# EAGLE design DIYBadgeKit-v10 (EAGLE 6.3)
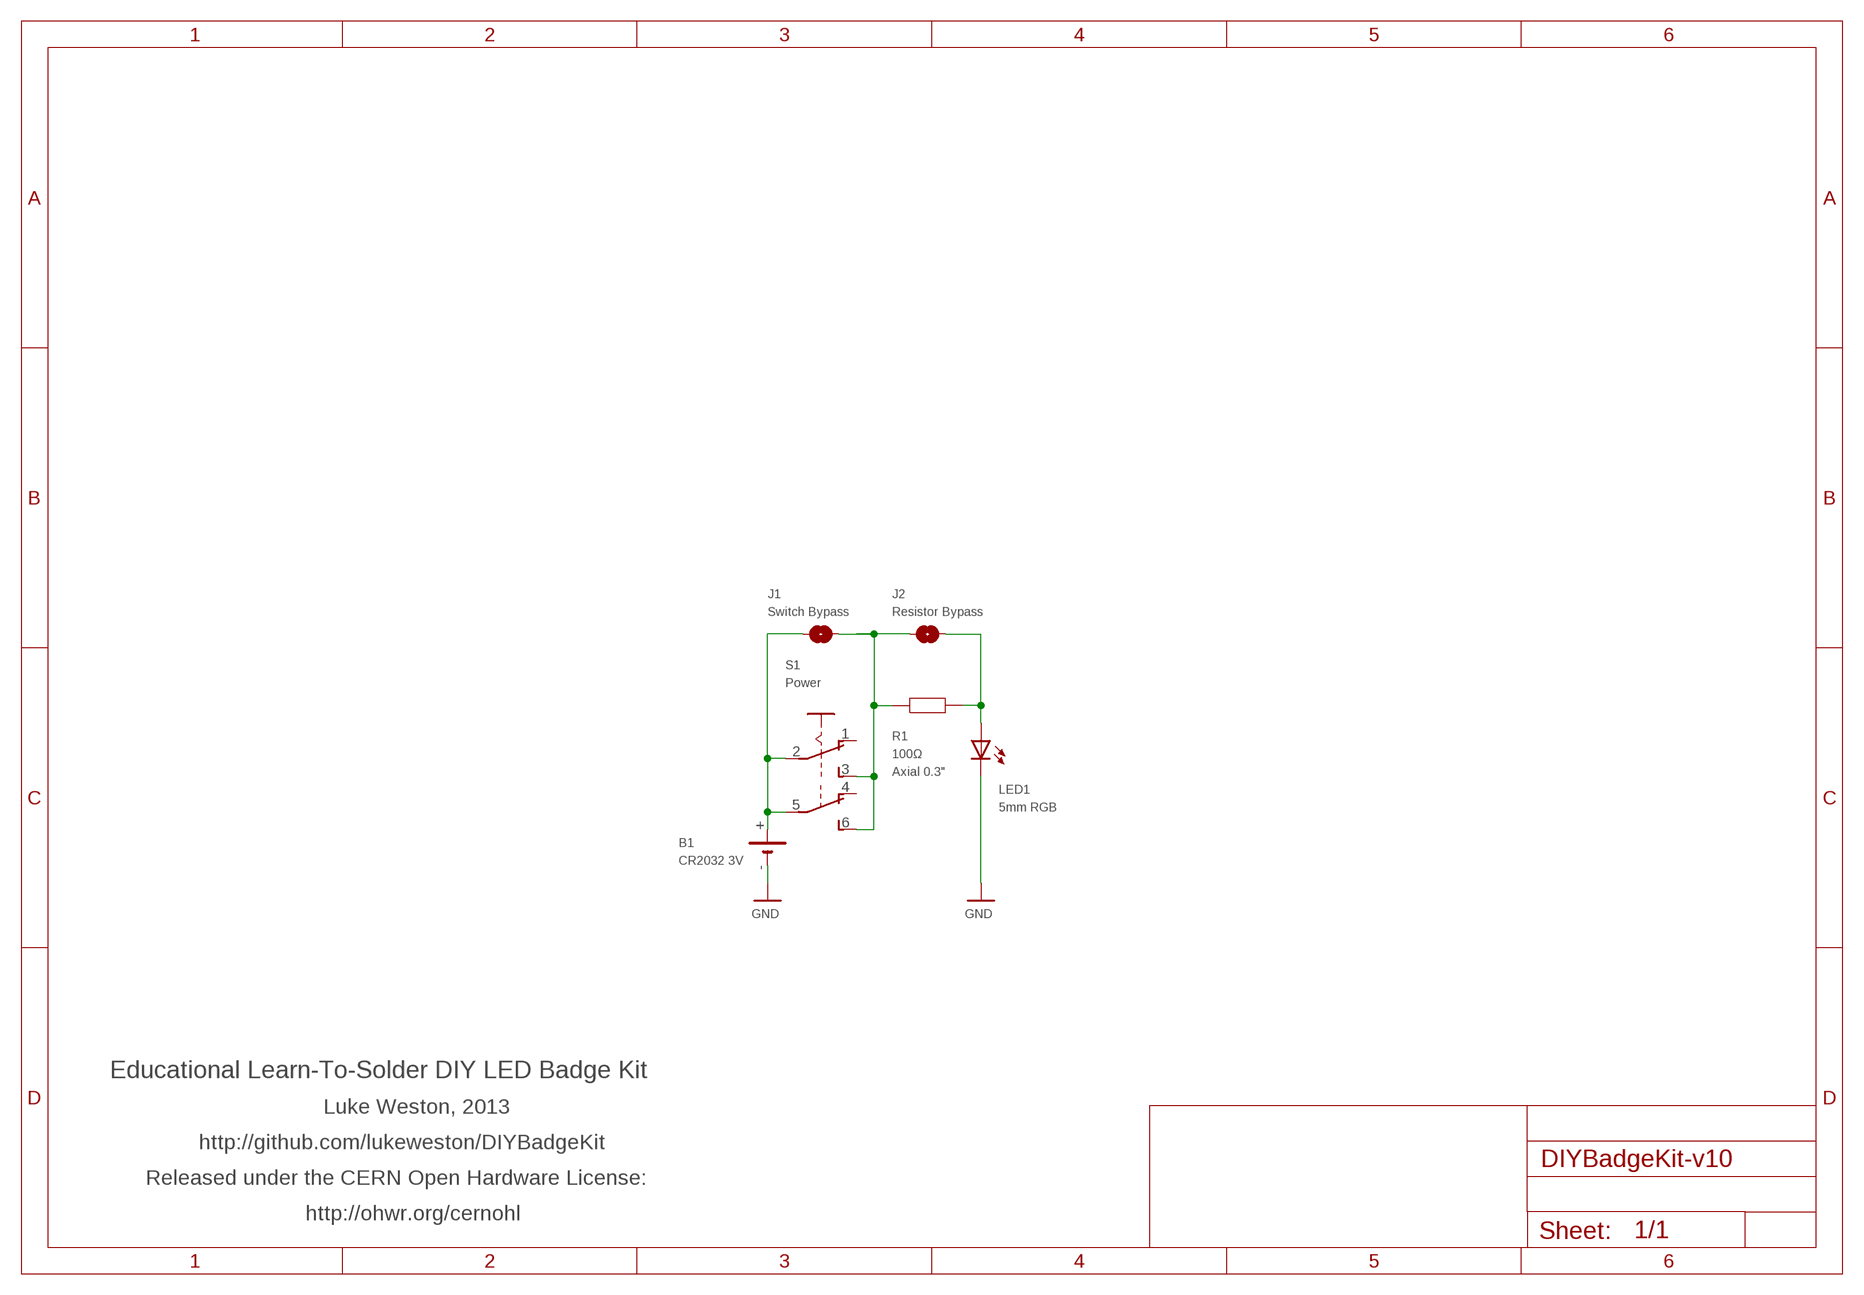
[diagram p0: schematic, sheet 1]

## Parts
B1  CR2032 3V  B2430UNI  [B2430UNI]
J1  Switch Bypass  SJ  [SJ]
J2  Resistor Bypass  SJ  [SJ]
LED1  5mm RGB  LED5MM  [LED5MM]
R1  100Ω  RESISTORPTH1  [AXIAL-0.3]
S1  Power  A68-A31  [A68-A31]

## Nets
GND: B1.- B1.-@1(-) LED1.K(C)
J2: J2.2 LED1.A R1.P$2
N$2: J1.2 J2.1 R1.P$1 S1.3(A:S) S1.6(B:S)
N$3: B1.+ B1.+@1(+) B1.+@2(+) B1.+@3(+) B1.+@4(+) J1.1 S1.2(A:P) S1.5(B:P)
Unconnected: S1.1(A:O) S1.4(B:O)

## Notes on the sheet
- Educational Learn-To-Solder DIY LED Badge Kit
- Luke Weston, 2013
- http://github.com/lukeweston/DIYBadgeKit
- Released under the CERN Open Hardware License:
- http://ohwr.org/cernohl

## Library data of the parts
B1 = battery:B2430UNI: LI BATTERY
J1 J2 = freetronics-luke:SJ: PCB "solder jumper". Note that there should nothing on the BOM corresponding to this "component".
LED1 = freetronics-master-v1:LED: LEDs Standard schematic elements and footprints for 5mm, 3mm, 1206, and 0603 sized LEDs. 5mm - Spark Fun Electronics SKU : COM-00529 (and others)
R1 = freetronics-master-v1:RESISTOR: Resistor Basic schematic elements and footprints for 0603, 1206, and PTH 1/10th watt (small) resistors.; PACKAGE: Axial 0.3"
S1 = switch:A68-A31: SLIDING SWITCH Siemens, distributor Buerklin, 11G766

## Board
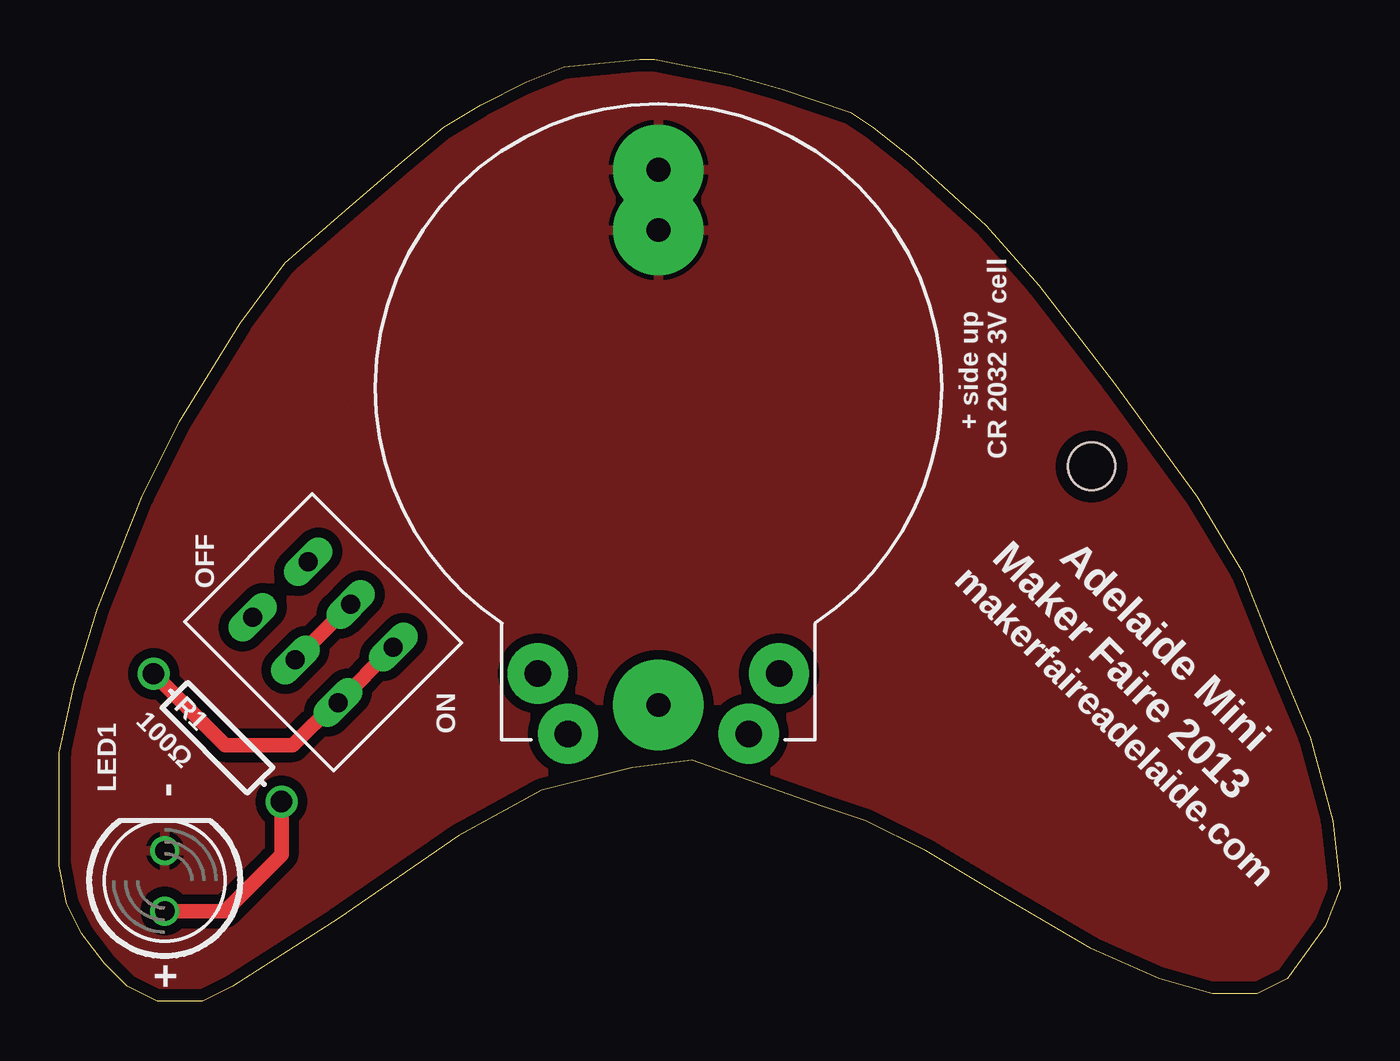
[diagram p1: board, top side]
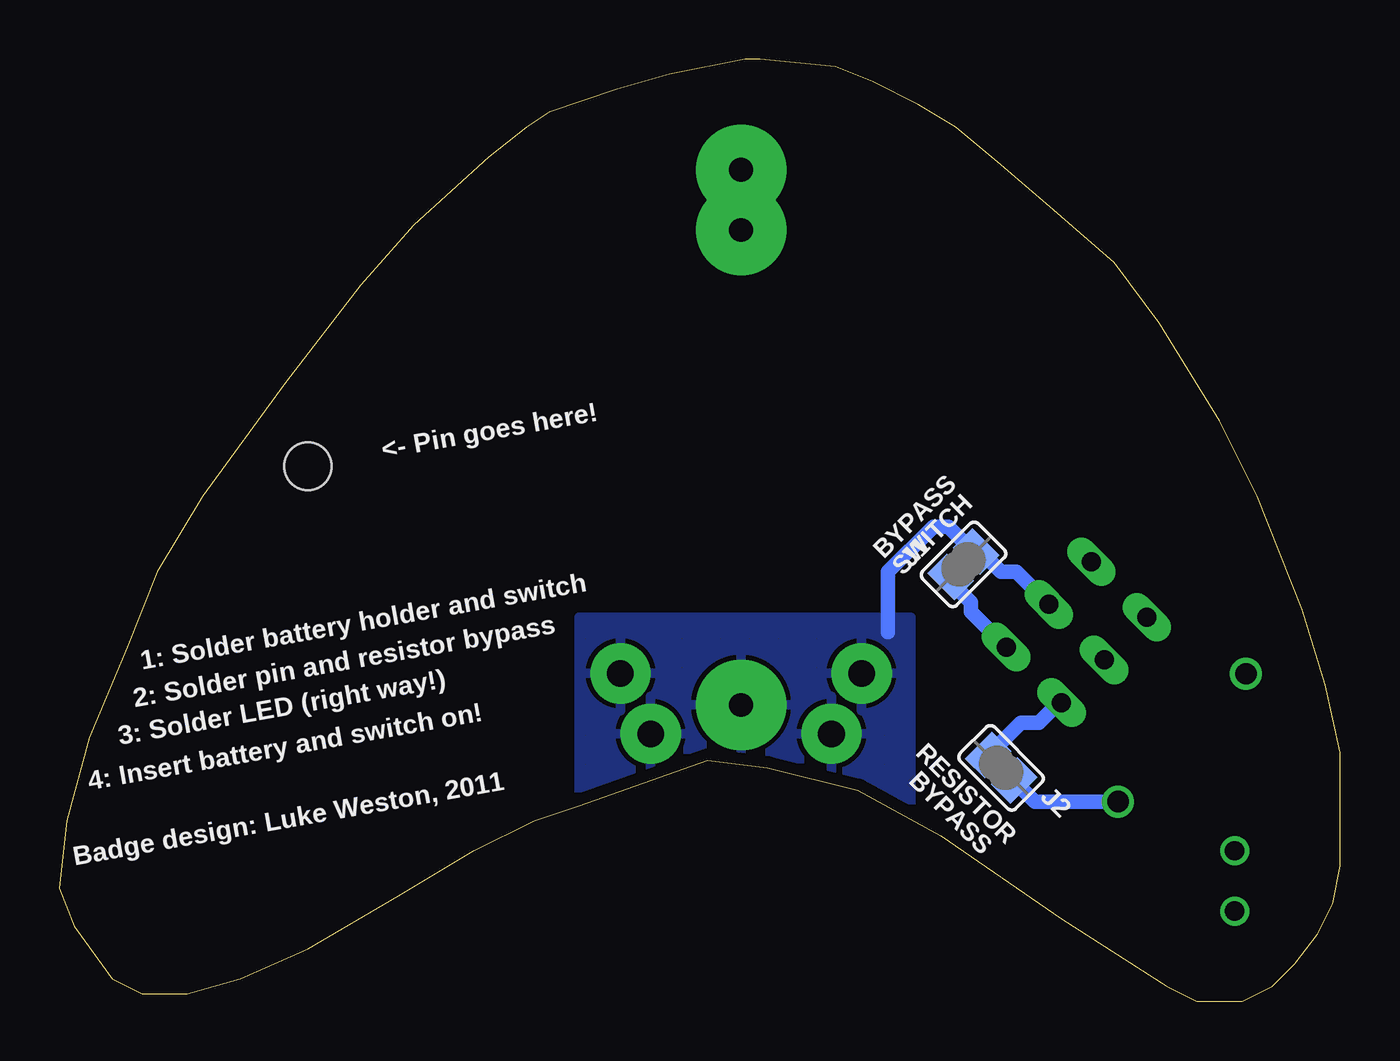
[diagram p2: board, bottom side, seen from below]

Size 53.98 x 39.69 mm. Coordinates in mm from the lower left corner, seen from the top.
Outline: 35.88,35.56 39.05,32.7 41.27,30.16 44.45,26.03 47.94,21.27 49.85,18.1 51.12,14.92 52.7,11.11 53.66,7.62 53.98,4.76 53.34,3.18 51.75,0.95 50.48,0.32 48.58,0.32 46.36,0.95 43.5,2.22 39.69,4.44 36.51,6.35 33.97,7.62 32.07,8.25 26.67,10.16 24.13,9.84 20.32,8.89 16.83,6.98 11.75,3.49 7.3,0.64 6.03,0 4.13,0 2.86,0.64 1.91,1.59 0.95,2.86 0.32,4.13 0,5.72 0,10.48 0.63,13.33 1.59,16.51 3.49,21.27 5.08,24.45 7.62,28.58 9.52,31.12 12.07,33.34 14.29,35.24 16.19,36.83 17.78,37.78 19.69,38.73 21.27,39.37 24.45,39.69 25.08,39.69 28.26,39.05 30.48,38.42 33.34,37.47 34.29,36.83 35.88,35.56
Copper layers (1*16): Top 0.035mm / dielectric 1.5mm / Bottom 0.035mm
Design rules "PCBCart-Standard": minimum track width 8mil, minimum drill 0.4mm, track to track 8mil, track to pad 8mil, pad to pad 8mil, via to via 8mil, smd to smd 8mil, copper to edge 20mil, drill to drill 8mil, minimum pad ring 8mil, minimum via ring 10mil, stop-mask expansion 3mil, vias tented up to drill 0mil, thermal gap 8mil
Holes 2 mm at 43.5,22.54

### Footprints (pad centres in the part's own frame; a part is rotated, then mirrored left to right if it is on the bottom)
B2430UNI = drill 1.118 pad 2.54: + 3.81,14.605; +@1 -3.81,14.605; +@2 -5.08,12.065; +@3 5.08,12.065 | drill 1 pad 3.81: +@4 0,13.389; - 0,-6.611; -@1 0,-9.151
SJ = smd 1.168 x 1.6: 1 -0.762,0; 2 0.762,0
LED5MM = drill 0.813: A -1.27,0; K 1.27,0
AXIAL-0.3 = drill 0.9: P$1 -3.81,0; P$2 3.81,0
A68-A31 = drill 0.8 long: 1 -2.54,-1.651; 2 0,-1.651; 3 2.54,-1.651; 4 -2.54,1.651; 5 0,1.651; 6 2.54,1.651

### Placement (x,y rotation side)
B1  25.25,25.88 180 top
J1  15.88,18.42 225 bottom
J2  14.29,9.84 315 bottom
LED1  4.45,5.08 90 top
R1  6.67,11.11 315 top
S1  11.11,15.56 315 top

### Tracks (layer width: path | path; a pad name or v marks a point on that pad's centre or on a via)
GND
  pour Top (isolate 0.406, hatched): -1.59,40.96 55.56,40.96 55.56,-0.95 -1.59,-0.95
J2
  Top 0.61: LED1.A 6.99,3.81 9.36,6.19 R1.P$2
  Bottom 0.61: R1.P$2 12.86,8.42 J2.2
N$2
  Top 0.61: S1.6 S1.3 11.64,12.59 9.84,10.8 6.99,10.8 R1.P$1
  Bottom 0.406: J1.2 16.41,17.68 | S1.3 11.85,12.59
  Bottom 0.61: 16.41,17.68 15.56,16.83 15.56,16.41 S1.6 | 11.85,12.59 12.7,11.75 13.46,11.75 J2.1
N$3
  Top 0.61: S1.5 S1.2
  Bottom 0.406: 15.14,18.95 J1.1 15.46,18.95
  Bottom 0.61: 15.14,18.95 14.29,18.1 13.65,18.1 S1.5 | 15.46,18.95 16.51,20 17.14,20 19.05,18.1 19.05,15.56
  pour Bottom (isolate 0.406, hatched): 32.07,16.19 32.07,7.3 18.1,7.3 18.1,16.19

### Text on the board
tPlace: CR 2032 3V cell | + side up | OFF | Maker Faire 2013 | Adelaide Mini | makerfaireadelaide.com | ON | - | +
bPlace: <- Pin goes here! | SWITCH | BYPASS | 1: Solder battery holder and switch | 2: Solder pin and resistor bypass | 3: Solder LED (right way!) | 4: Insert battery and switch on! | RESISTOR | BYPASS | Badge design: Luke Weston, 2011